# EasyEDA Pro project ProDocument_Board2_2024-09-15.epro, board PCB1_1
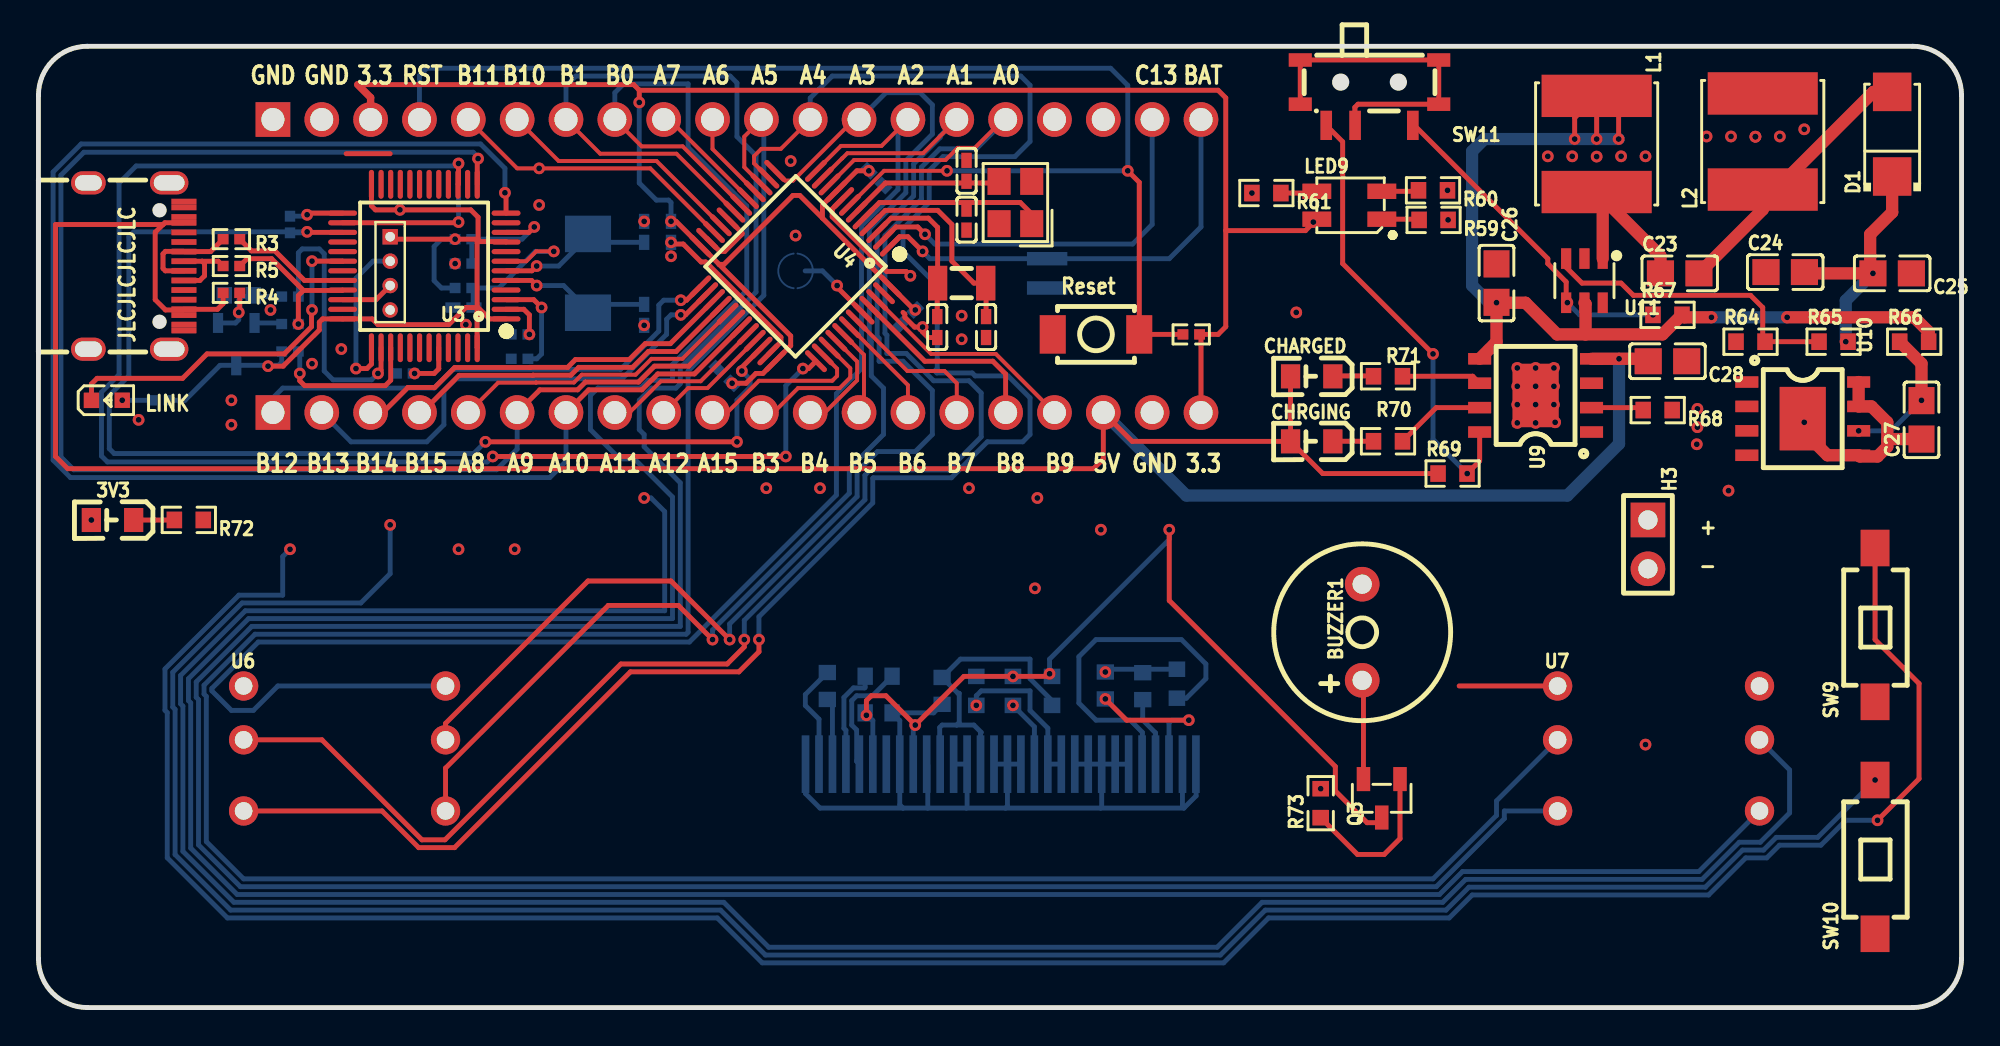
[diagram p1: board, top side]
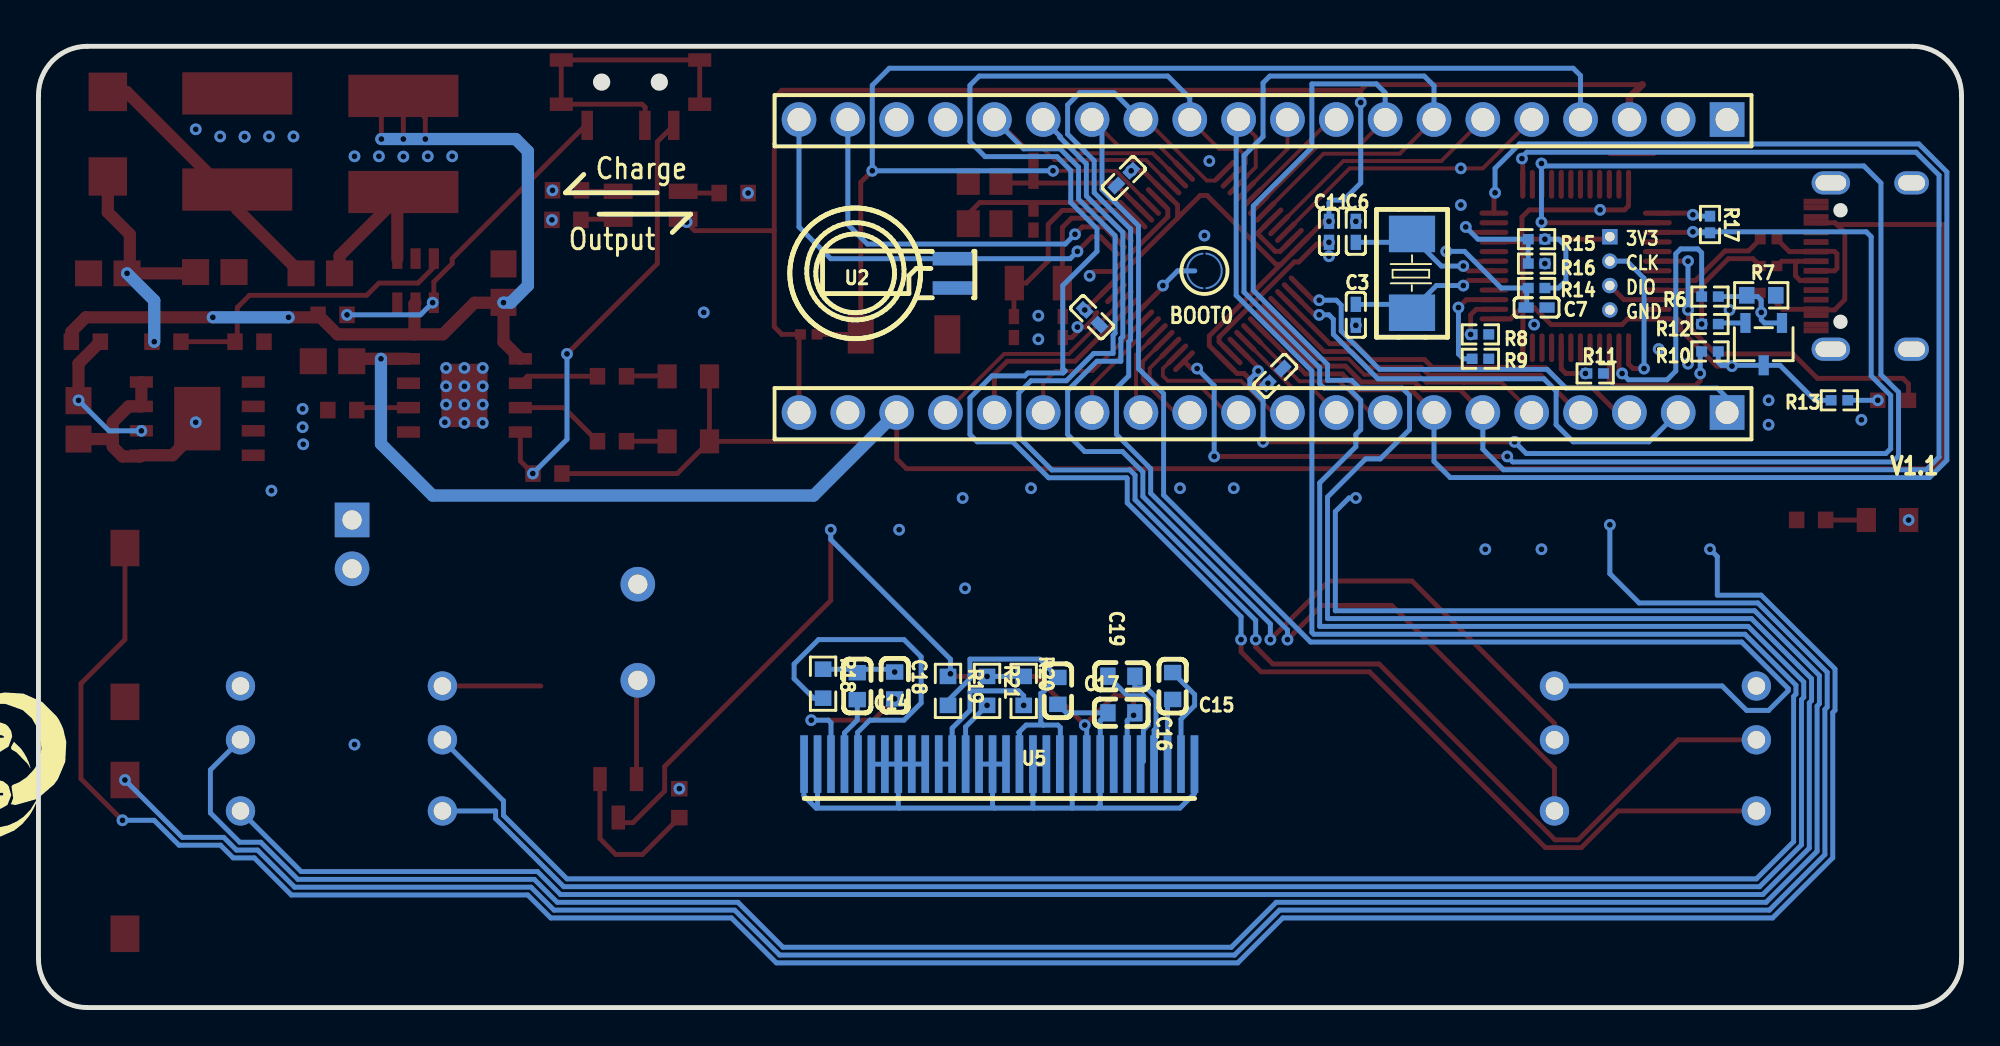
[diagram p2: board, bottom side, seen from below]

Outline 100 x 50 mm; copper layers: Top Layer, Inner1, Inner2, Bottom Layer. Coordinates in mm from the lower left corner of the outline.
Outline path: 0,47.46 0,2.54 arc(0.74,0.74) 2.54,0 97.46,0 arc(99.26,0.74) 100,2.54 100,47.46 arc(99.26,49.26) 97.46,50 2.54,50 arc(0.74,49.26) 0,47.46
Stack: Top Layer 0.035mm 外层铜厚1oz / Dielectric1 0.2104mm 7628 RC49% 8.6mil / Inner1 0.0152mm 内层铜厚 / Dielectric2 1.065mm 1.1mm H/HOZ 含铜 / Inner2 0.0152mm 内层铜厚 / Dielectric3 0.2104mm 7628 RC49% 8.6mil / Bottom Layer 0.035mm 外层铜厚1oz

## Design rules (mm)
spacing safeClearance (default): track to track 0.152, other pairs 0.152 to 0.3
track width trackWidth (default): min 0.127, default 0.254, max 2.54
differential pair differentialPair (default): width min 0.127, default 0.254, max 2.54; gap min 0.152, default 0.152
via viaSize (default): diameter min 0.5, default 0.61, max 10; hole min 0.3, default 0.305, max 6

## Placement (name value [footprint] x y rotation side)
3V3  -  [LED_0805]  3.8 25.36 180 top
BUZZER1  2.7kHz  [BUZ-TH_BD9.0-P5.00-D0.6-FD]  68.83 19.52 90 top
C3  20pF  [C0402]  31.5 36.03 270 bottom
C4  12pF  [C0402]  46.74 35.39 90 top
C5  12pF  [C0402]  49.28 35.39 270 top
C6  20pF  [C0402]  31.5 40.35 90 bottom
C7  100nF  [C0402]  22.1 36.41 0 bottom
C8  20pF  [C0402]  48.26 40.98 90 top
C9  20pF  [C0402]  48.26 43.52 270 top
C10  100nF  [C0402]  43.56 43.14 135 bottom
C11  100nF  [C0402]  32.89 40.35 90 bottom
C12  100nF  [C0402]  35.69 32.86 315 bottom
C13  100nF  [C0402]  45.21 35.9 45 bottom
C14  4.7uf  [C0603]  57.42 16.72 270 bottom
C15  1uf  [C0603]  43.69 17.23 0 bottom
C16  1uf  [C0603]  41.02 16.73 90 bottom
C17  10uf  [C0603]  43.69 15.33 180 bottom
C18  2.2uf  [C0603]  55.48 16.75 270 bottom
C19  100nF  [C0603]  46.99 16.47 270 bottom
C23  22uF  [C0805]  85.34 38.19 0 top
C24  22uF  [C0805]  90.83 38.26 0 top
C25  22uF  [C0805]  96.39 38.19 180 top
C26  22uF  [C0805]  75.82 37.68 270 top
C27  4.7uF  [C0805]  97.92 30.57 90 top
C28  22uF  [C0805]  84.71 33.62 180 top
CHARGED  -  [LED_0805]  66.16 32.84 180 top
CHRGING  -  [LED_0805]  66.16 29.46 180 top
D1  SS34  [SMA_L4.3-W2.6-LS5.2-RD]  96.39 45.43 90 top
H3  -  [HDR-TH_2P-P2.54-V-M-1]  83.69 24.09 270 top
J1  -  [HDR-TH_20P-P2.54-V-M-1]  36.32 46.19 0 bottom
J2  -  [HDR-TH_20P-P2.54-V-M-1]  36.32 30.95 0 bottom
L1  4.7uH  [IND-SMD_L6.0-W6.0]  81.03 44.92 270 top
L2  4.7uH  [IND-SMD_L6.0-W6.0]  89.66 45.05 90 top
LED2  NCD0603Y1  [LED0603-RD]  3.56 31.58 0 top
LED9  LED-RGB-3528  [LED 3528-4PIN]  68.17 41.73 0 top
P1  -  [1.27-4P烧录孔]  18.29 38.19 270 top
PAN1  -  [短接焊盘-2mm]  39.37 38.32 0 bottom
Q1  S8050 J3Y  [SOT-23-3_L3.0-W1.7-P0.95-LS2.9-BR]  10.29 34.51 90 bottom
Q3  S8550  [SOT-23-3_L2.9-W1.3-P1.90-LS2.4-BR]  69.85 10.88 90 top
R2  10kΩ  [R0402]  59.94 35.01 0 top
R3  10Ω  [R0402]  10.03 39.97 0 top
R4  10kΩ  [R0402]  10.03 37.17 180 top
R5  10Ω  [R0402]  10.03 38.57 0 top
R6  100Ω  [R0402]  13.08 36.98 0 bottom
R7  36kΩ  [R0603]  10.41 37.05 0 bottom
R8  10kΩ  [R0402]  25.02 35.01 180 bottom
R9  10kΩ  [R0402]  25.02 33.74 180 bottom
R10  4.7kΩ  [R0402]  13.08 34.12 180 bottom
R11  10kΩ  [R0402]  19.05 32.98 0 bottom
R12  1.5kΩ  [R0402]  13.08 35.55 180 bottom
R13  1kΩ  [R0402]  6.35 31.58 180 bottom
R14  100kΩ  [R0402]  22.1 37.43 180 bottom
R15  4.7kΩ  [R0402]  22.1 39.97 180 bottom
R16  4.7kΩ  [R0402]  22.1 38.7 0 bottom
R17  100Ω  [R0402]  13.08 40.73 270 bottom
R18  1M  [R0603]  59.2 16.84 270 bottom
R19  5.1k  [R0603]  52.71 16.47 270 bottom
R20  5.1k  [R0603]  48.77 16.47 270 bottom
R21  5.1k  [R0603]  50.67 16.47 270 bottom
R59  1k  [R0603]  72.55 40.97 180 top
R60  2k  [R0603]  72.52 42.51 180 top
R61  510  [R0603]  63.85 42.37 180 top
R64  2K  [R0603]  89.03 34.63 0 top
R65  9.1K  [R0603]  93.34 34.63 0 top
R66  100  [R0603]  97.54 34.63 0 top
R67  100K  [R0603]  84.71 36.03 0 top
R68  1.2K  [R0603]  84.2 31.08 180 top
R69  100K  [R0603]  73.53 27.78 0 top
R70  1.2K  [R0603]  70.18 29.46 180 top
R71  1.2K  [R0603]  70.18 32.84 180 top
R72  1.2K  [R0603]  7.82 25.36 180 top
R73  1kΩ  [R0603]  66.68 10.63 90 top
SW1  -  [SW-SMD_L3.9-W2.9-P4.15-LS5.0]  54.99 35.01 0 top
SW9  TS-1101-C-W  [SW-SMD_L6.0-W3.3-LS8.0]  95.5 19.9 90 top
SW10  TS-1101-C-W  [SW-SMD_L6.0-W3.3-LS8.0]  95.5 7.84 90 top
SW11  MSK12C02  [SW-TH_MSK12C02]  69.22 47.59 180 top
U2  -  [CAP-SMD_FL11E]  52.45 38.19 180 bottom
U3  STM32F103CBT6  [LQFP-48_L7.0-W7.0-P0.50-LS9.0-BL]  20.07 38.57 90 top
U4  -  [LQFP-48_L7.0-W7.0-P0.50-LS9.0-BL]  39.37 38.57 135 top
U5  SSD1306  [1.3OLED-2]  50.42 13.42 0 bottom
U6  -  [直插五向开关]  10.67 16.73 0 top
U7  -  [直插五向开关]  78.99 16.73 0 top
U9  TP4056-42-ESOP8  [ESOP-8_L4.9-W3.9-P1.27-LS6.0-BL-EP]  77.85 31.84 90 top
U10  IP3005A  [ESOP-8_L4.9-W3.9-P1.27-LS6.0-BL-EP]  91.74 30.63 270 top
U11  MT3608  [SOT-23-6_L2.9-W1.6-P0.95-LS2.8-BL]  80.39 37.81 180 top
USB1  -  [USB-C_SMD-TYPE-C-31-M-12]  5.08 38.57 270 top
X1  32.768kHz  [FC-135R_L3.2-W1.5]  48.01 37.68 0 top
X2  8MHz  [CRYSTAL-SMD_L5.0-W3.2]  28.57 38.19 270 bottom
X3  8MHz  [CRYSTAL-SMD_4P-L3.2-W2.5-BL]  50.8 41.87 90 top

## Footprints (pads in the part's own frame, mm; a bottom-side part is the same pattern mirrored in y, then rotated)
1.3OLED-2
  rect 0.4x3 smd: 1(-10.531,0.762) 2(-9.831,0.763) 3(-9.131,0.762) 4(-8.431,0.762) 5(-7.731,0.762) 6(-7.031,0.762) 7(-6.331,0.762) 8(-5.631,0.762) 9(-4.931,0.762) 10(-4.231,0.762) 11(-3.531,0.762) 12(-2.831,0.762) 13(-2.131,0.762) 14(-1.431,0.762) 15(-0.731,0.762) 16(-0.031,0.762) 17(0.669,0.762) 18(1.369,0.762) 19(2.069,0.763) 20(2.769,0.762) 21(3.469,0.761) 22(4.169,0.762) 23(4.869,0.762) 24(5.569,0.762) 25(6.269,0.763) 26(6.969,0.762) 27(7.669,0.763) 28(8.369,0.762) 29(9.069,0.762) 30(9.769,0.762)
1.27-4P烧录孔
  rect 0.8x0.8 hole 0.5: 1(-1.905,0)
  round 0.8 hole 0.5: 2(-0.635,0) 3(0.635,0) 4(1.905,0)
BUZ-TH_BD9.0-P5.00-D0.6-FD
  round 1.8 hole 1: 1(-2.5,0) 2(2.5,0)
C0402
  rect 0.79x0.54 smd: 1(-0.545,0) 2(0.545,0)
C0603
  rect 0.8x0.9 smd: 1(-0.7,0) 2(0.7,0)
C0805
  rect 1.41x1.35 smd: 1(-1,0) 2(1,0)
CAP-SMD_FL11E
  rect 2.1x0.7 smd: 1(0,0.762) 2(0,-0.762)
CRYSTAL-SMD_4P-L3.2-W2.5-BL
  rect 1.4x1.2 smd: 1(-1.1,-0.85) 2(1.1,-0.85) 3(1.1,0.85) 4(-1.1,0.85)
CRYSTAL-SMD_L5.0-W3.2
  rect 1.9x2.401 smd: 1(-2.05,0) 2(2.05,0)
ESOP-8_L4.9-W3.9-P1.27-LS6.0-BL-EP
  rect 0.6x1.2 smd: 1(-1.905,-2.909) 2(-0.635,-2.909) 3(0.635,-2.909) 4(1.905,-2.909) 5(1.905,2.909) 6(0.635,2.909) 7(-0.635,2.909) 8(-1.905,2.909)
  rect 3.3x2.4 smd: 9(0,0)
FC-135R_L3.2-W1.5
  rect 1.001x1.801 smd: 1(-1.25,0) 2(1.25,0)
HDR-TH_2P-P2.54-V-M-1
  rect 1.8x1.8 hole 1: 1(-1.27,0)
  round 1.8 hole 1: 2(1.27,0)
HDR-TH_20P-P2.54-V-M-1
  rect 1.801x1.801 hole 1.199: 1(-24.13,0)
  round 1.801 hole 1.199: 2(-21.59,0) 3(-19.05,0) 4(-16.51,0) 5(-13.97,0) 6(-11.43,0) 7(-8.89,0) 8(-6.35,0) 9(-3.81,0) 10(-1.27,0) 11(1.27,0) 12(3.81,0) 13(6.35,0) 14(8.89,0) 15(11.43,0) 16(13.97,0) 17(16.51,0) 18(19.05,0) 19(21.59,0) 20(24.13,0)
IND-SMD_L6.0-W6.0
  rect 2.2x5.72 smd: 1(-2.5,0) 2(2.5,0)
LED0603-RD
  rect 0.8x0.8 smd: 1(-0.799,-0.004) 2(0.799,0.004)
LED 3528-4PIN
  custom 1.5x0.8 smd: 1(1.689,-0.725) 2(-1.689,-0.725) 3(-1.689,0.725) 4(1.689,0.725)
LED_0805
  rect 1x1.25 smd: 1(-1.15,0.005) 2(1.05,0.005)
LQFP-48_L7.0-W7.0-P0.50-LS9.0-BL
  oval 0.269x1.501 smd: 1(-2.751,-4.25) 2(-2.251,-4.25) 3(-1.75,-4.25) 4(-1.25,-4.25) 5(-0.75,-4.25) 6(-0.249,-4.25) 7(0.249,-4.25) 8(0.75,-4.25) 9(1.25,-4.25) 10(1.75,-4.25) 11(2.251,-4.25) 12(2.751,-4.25) 25(2.751,4.25) 26(2.251,4.25) 27(1.75,4.25) 28(1.25,4.25) 29(0.75,4.25) 30(0.249,4.25) 31(-0.249,4.25) 32(-0.75,4.25) 33(-1.25,4.25) 34(-1.75,4.25) 35(-2.251,4.25) 36(-2.751,4.25)
  oval 1.501x0.269 smd: 13(4.25,-2.751) 14(4.25,-2.251) 15(4.25,-1.75) 16(4.25,-1.25) 17(4.25,-0.75) 18(4.25,-0.249) 19(4.25,0.249) 20(4.25,0.75) 21(4.25,1.25) 22(4.25,1.75) 23(4.25,2.251) 24(4.25,2.751) 37(-4.25,2.751) 38(-4.25,2.251) 39(-4.25,1.75) 40(-4.25,1.25) 41(-4.25,0.75) 42(-4.25,0.249) 43(-4.25,-0.249) 44(-4.25,-0.75) 45(-4.25,-1.25) 46(-4.25,-1.75) 47(-4.25,-2.251) 48(-4.25,-2.751)
R0402
  rect 0.566x0.54 smd: 1(-0.433,0) 2(0.433,0)
R0603
  rect 0.806x0.864 smd: 1(-0.753,0) 2(0.753,0)
SMA_L4.3-W2.6-LS5.2-RD
  rect 2x2 smd: 1(-2.2,0) 2(2.2,0)
SOT-23-3_L2.9-W1.3-P1.90-LS2.4-BR
  rect 1.25x0.7 smd: 1(1,-0.95) 2(1,0.95) 3(-1,0)
SOT-23-3_L3.0-W1.7-P0.95-LS2.9-BR
  rect 1.038x0.532 smd: 1(1.101,-0.95) 2(1.101,0.95) 3(-1.101,0)
SOT-23-6_L2.9-W1.6-P0.95-LS2.8-BL
  rect 0.532x1.072 smd: 1(-0.95,-1.149) 2(0,-1.149) 3(0.95,-1.149) 4(0.95,1.149) 5(0,1.149) 6(-0.95,1.149)
SW-SMD_L3.9-W2.9-P4.15-LS5.0
  rect 1.351x1.999 smd: 1(-2.251,0) 2(2.251,0)
SW-SMD_L6.0-W3.3-LS8.0
  rect 1.9x1.5 smd: 1(-4,0) 2(4,0)
SW-TH_MSK12C02
  rect 0.6x1.524 smd: 1(-2.25,1.7) 2(0.75,1.7) 3(2.25,1.7)
  rect 1.2x0.7 smd: 4(-3.6,0.6) 4(-3.6,-1.7) 4(3.6,0.6) 4(3.6,-1.7)
USB-C_SMD-TYPE-C-31-M-12
  oval 1.2x2 hole 0.8x1.6: 0(-4.325,1.716) 0(4.325,1.716)
  oval 1.2x1.8 hole 0.8x1.4: 0(-4.325,-2.484) 0(4.325,-2.484)
  rect 0.3x1.3 smd: A1(-3.35,2.484) A4(-2.55,2.484) A5(-1.25,2.484) A6(-0.25,2.484) A7(0.25,2.484) A8(1.25,2.484) A9(2.55,2.484) A12(3.35,2.484) B1(3.05,2.484) B4(2.25,2.484) B5(1.75,2.484) B6(0.75,2.484) B7(-0.75,2.484) B8(-1.75,2.484) B9(-2.25,2.484) B12(-3.05,2.484)
直插五向开关
  round 1.524 hole 0.914: 1(0,0) 2(0,-2.8) 3(0,-6.5) 4(10.5,0) 5(10.5,-2.8) 6(10.5,-6.5)
短接焊盘-2mm
  custom 0.8x1.8 smd: 1(-0.5,0) 2(0.5,0)

## Nets
As in the schematic, except:
3V3: 3V3.2 C10.2 C11.2 C12.2 C13.2 C17.2 C24.2 C25.2 D1.1 J1.3 J2.20 LED9.2 P1.1 Q1.3 Q3.3 R2.2 R10.2 R13.1 R14.2 R15.2 R19.1 R20.1 R21.1 R65.2 U3.1 U3.9 U3.24 U3.36 U3.48 U4.9 U4.24 U4.36 U4.48 U5.6 U5.9
+5V: C28.2 CHARGED.2 CHRGING.2 J2.18 R4.2 R69.1 U9.4 USB1.A4 USB1.A9 USB1.B4 USB1.B9
$1N40276: CHRGING.1 R70.2
$1N40277: CHARGED.1 R71.2
$1N44946: 3V3.1 R72.2

Pads without a net: J1 17 18; U3 4 11 14 16 17 18 19 21 22 28 29 31 40 41 42 43 45 46; U5 7; U10 1; U11 6; USB1 A5 A8 B5 B8

## Via types
v1: diameter 0.61, hole 0.305, Top Layer to Bottom Layer, 140 vias

## Routing (per net, layer and track width the routed paths; a pad name or vN(x,y) marks a point on that pad's centre or on a via; arc(x,y) is an arc through that point)
3V3: length 273.5
  Top Layer w0.254: U3.9 24.3,39.84 22.81,39.84 22.81,36.41 ; 40.77,41.06 U4.48 45.55,36.28 v1(45.59,36.28) ; 40.77,41.06 40.77,41.75 41.48,42.46 U4.9 42.56,43.52 v1(43.18,43.52) ; 40.77,41.06 39.59,42.24 39.23,42.24 35.65,38.66 35.39,38.66 ; 31.24,47.71 30.95,48 16.6,48 ; 31.24,47.71 61.34,47.71 61.74,47.31 61.74,40.41 ; 31.24,47.71 v1(31.24,47.08) ; v1(66.29,40.86) 66.44,41.01 LED9.2 65.88,40.41 61.74,40.41 ; v1(43.05,15.2) 43.05,15.96 43.31,16.22 44.07,16.22 v1(45.59,14.69) 48.12,17.22 v1(50.67,17.22) 52.58,17.22 v1(52.58,17.36) ; 61.74,40.41 61.74,35.41 61.34,35.01 R2.2 60.45,34.94 J2.20 ; 22.81,36.41 22.22,36.41 21.34,35.52 17.65,35.52 17.36,35.82 14.78,35.82 14.61,35.65 14.61,35.24 12.73,33.36 v1(11.94,33.36) ; 22.81,36.41 22.81,34.33 U3.48 ; 24.32,35.82 23.45,35.82 22.86,36.41 ; 35.39,38.66 39.12,34.93 39.12,34.43 U4.36 37.67,32.98 37.31,32.98 36.8,32.47 v1(36.07,32.47) ; 35.39,38.66 U4.24 33.16,40.89 v1(32.89,40.89) ; Q3.3 69.58,9.61 69.09,9.61 67.44,11.27 67.44,12.53 58.8,21.17 v1(58.8,24.85) ; U3.24 17.31,41.7 17.53,41.49 v1(18.8,41.49) 22.48,41.49 22.86,41.11 22.86,39.97 v1(21.67,39.97) 18.42,39.97 P1.1
  Top Layer w0.381: 16.6,48 17.27,47.33 J1.3
  Top Layer w0.635: D1.1 96.39,41.36 95.25,40.22 95.25,38.33 v1(95.39,38.19) 91.9,38.19 C24.2 ; v1(93.98,34.63) R65.2
  Inner1 w0.254: v1(66.29,40.86) 72.52,34.63 v1(93.98,34.63) ; v1(18.8,41.49) 17.65,41.49 17.27,41.87 J1.3 ; v1(11.94,33.36) 11.3,33.36 10.54,32.6 9.99,32.6 v1(2.75,25.36) ; J2.20 58.8,29.3 v1(58.8,24.85)
  Bottom Layer w0.254: U5.9 45.49,14.59 v1(45.59,14.69) ; R10.2 12.65,33.56 12.49,33.4 Q1.3 9.44,33.4 7.62,31.58 R13.1 ; R14.2 20.95,37.43 20.57,37.81 20.57,39.59 20.95,39.97 v1(21.67,39.97) ; 48.77,17.22 v1(50.67,17.22) ; 52.71,17.22 52.71,17.23 v1(52.58,17.36) 52.58,18.12 58.8,24.35 v1(58.8,24.85) ; U5.6 43.39,14.93 C17.2 42.99,15.27 v1(43.05,15.2) ; v1(32.89,40.89) 32.89,41.87 32.77,42 32.13,42 31.24,42.89 v1(31.24,47.08)
  Bottom Layer w0.635: v1(95.39,38.19) 93.98,36.78 v1(93.98,34.63)
+5V: length 143.9
  Top Layer w0.254: 6.48,40.73 6.57,40.82 USB1.B9 ; R4.2 9.6,36.61 9.31,36.32 USB1.B4 7.53,36.28 6.61,36.28 6.07,36.82 6.07,40.32 6.48,40.73 0.89,40.73 0.89,28.66 1.52,28.03 54.86,28.03 55.37,28.54 J2.18 56.87,29.45 CHRGING.2 ; R69.1 66.78,27.78 CHRGING.2 ; CHRGING.2 CHARGED.2
  Top Layer w0.635: C28.2 83.58,33.74 v1(82.19,33.74) U9.4
  Bottom Layer w0.635: J2.18 59.69,26.63 79.5,26.63 82.19,29.32 v1(82.19,33.74)
GND: length 111.7
  Top Layer w0.254: v1(32.89,39.8) 32.98,39.71 33.53,39.71 34.46,38.78 34.69,38.78 38.61,34.87 38.61,34.63 U4.35 ; U7.1 73.88,16.73 ; U4.8 41.28,41.53 41.28,41.13 44.12,38.29 45.11,38.29 v1(45.34,38.06) ; 18.29,44.41 16,44.41 ; SW11.4 SW11.4 SW11.4 SW11.4 68.62,46.99 68.45,46.83 68.45,45.9 SW11.2 ; C4.1 46.26,34.85 45.97,35.14 v1(45.97,35.39) 45.56,35.39 45.05,35.9 45.05,36.06 44.96,36.16 ; U4.20 36.58,40.3 36.58,40.23 35.69,39.33 35.43,39.33 34.78,39.98 U4.23
  Inner1 w0.254: v1(51.82,21.81) 55.48,18.14 v1(55.48,17.45) ; v1(26.03,41.75) 26.67,41.11 26.67,40.35 25.02,38.7 v1(21.67,38.7)
  Bottom Layer w0.254: U5.30 60.2,12.65 60.2,11.01 59.56,10.38 ; 48.25,10.38 48.29,10.42 U5.13 U5.12 ; 48.25,10.38 50.28,10.38 ; 48.25,10.38 46.24,10.38 ; U5.1 39.89,11.13 40.64,10.38 44.96,10.38 ; 55.23,10.38 59.56,10.38 ; 55.23,10.38 55.29,10.43 U5.23 ; 55.23,10.38 50.28,10.38 ; 59.56,10.38 59.49,10.45 U5.29 ; R18.1 55.62,17.6 v1(55.48,17.45) ; U5.16 U5.17 ; U5.16 50.39,10.48 50.28,10.38 ; U5.16 U5.15 ; 46.24,10.38 46.24,12.61 U5.10 ; 46.24,10.38 44.96,10.38 ; U5.23 U5.24 ; U5.23 U5.22 U5.21 ; U5.25 55.99,12.66 ; C19.2 46.55,15.33 C17.1 44.79,14.93 U5.8 44.79,10.55 44.96,10.38
  vias: v1(5.21,30.57) v1(10.03,31.58) v1(10.03,30.31) v1(12.06,36.28) v1(14.22,33.49) v1(15.75,34.25) v1(21.84,23.84) v1(22.22,35.52) v1(24.77,23.84) v1(31.5,40.89) v1(31.5,35.48) v1(32.89,39.08) v1(39.12,44.03) v1(39.37,40.15) v1(48.01,35.99) v1(48.01,34.76) v1(55.25,24.85) v1(65.41,36.16) v1(76.9,33.27) v1(76.9,32.32) v1(76.9,31.36) v1(76.9,30.41) v1(77.85,33.27) v1(77.85,32.32) v1(77.85,31.36) v1(77.85,30.41) v1(78.49,44.28) v1(78.8,33.27) v1(78.8,32.32) v1(78.8,31.36) v1(78.87,30.44) v1(79.76,44.28) v1(81.03,44.26) v1(82.3,44.28) v1(83.57,44.28) v1(83.57,13.68) v1(86.23,29.3) v1(86.26,31.14) v1(86.26,30.19) v1(86.74,45.31) v1(87.88,26.89) v1(88.01,45.31) v1(89.28,45.3) v1(89.28,45.29) v1(90.55,45.31) v1(91.82,45.68)
VBAT: length 23.1
  Top Layer w0.254: U4.1 44.78,40.09 45.21,40.09 v1(45.97,39.33)
  Bottom Layer w0.254: J1.20 60.45,40.6 58.8,38.95 U2.1 46.35,38.95 v1(45.97,39.33)
6050_SCL: length 12.9
  Top Layer w0.203: U4.21 32.14,44.03 27.05,44.03 J1.6
6050_SDA: length 15.2
  Top Layer w0.203: U4.22 31.81,43.65 v1(26.03,43.65) ; 26.01,43.65 24.89,43.65 J1.5
  Top Layer w0.254: v1(26.03,43.65) 26.01,43.65
BACK1: length 64
  Top Layer w0.203: J1.13 42.42,46.19 39.24,43.02 38.81,43.02 U4.13
  Top Layer w0.254: v1(35.05,19.14) 33.27,20.92 29.63,20.92 21.17,12.45 U6.6
  Bottom Layer w0.254: J1.13 44.07,47.59 45.85,47.59 46.48,46.95 46.48,45.43 45.1,44.05 45.1,42.38 43.21,40.49 43.21,34.73 43.31,34.63 43.31,32.86 43.94,32.22 43.94,29.81 42.16,28.03 42.16,26.75 35.05,19.64 v1(35.05,19.14)
BACK2: length 170.2
  Top Layer w0.203: J1.8 31.37,44.79 33.5,44.79 36.54,41.75
  Bottom Layer w0.254: U7.6 86.34,7.07 74.05,7.07 72.85,5.88 10.33,5.88 7.92,8.29 7.92,15.85 7.8,15.97 7.8,17.1 10.92,20.23 32.97,20.23 32.97,26.56 30.99,28.54 30.23,28.54 28.7,30.06 28.7,31.84 29.08,32.22 31.3,32.22 31.71,32.63 32.97,32.63 32.97,33.45 36.83,37.31 36.83,41.69 33.78,44.74 33.78,48.04 30.43,48.04 29.97,47.59 J1.8
BAT+: length 65.9
  Top Layer w0.254: 81.03,47.21 L1.1 79.88,46.28 v1(79.88,45.17) ; 81.03,47.21 v1(81.03,45.17) ; 81.03,47.21 81.51,47.21 82.17,46.55 v1(82.17,45.17)
  Top Layer w0.635: U11.5 80.45,36.6 80.45,35.01 ; 80.45,35.01 78.97,35.01 77.33,36.66 75.84,36.66 C26.2 v1(75.82,36.67) 75.82,34.62 U9.5 ; 80.45,35.01 84.45,35.01 R67.2 85.59,35.9 v1(87,35.9) ; v1(90.93,35.9) 97.54,35.9 98.29,35.15 R66.2
  Inner2 w0.635: v1(87,35.9) 87.12,35.78 87.12,28.39 83.82,25.09
  Bottom Layer w0.635: v1(90.93,35.9) v1(87,35.9) ; v1(82.17,45.17) v1(81.03,45.17) v1(79.88,45.17) 75.18,45.17 74.55,44.54 74.55,37.55 75.44,36.67 v1(75.82,36.67)
BAT-: length 24.5
  Top Layer w0.254: v1(91.82,30.44) 91.82,30.55 U10.9
  Top Layer w0.635: 96.14,29.5 96.21,29.57 C27.1 ; 96.14,29.5 96.14,30.44 95.31,31.27 U10.7 U10.8 ; 96.14,29.5 96.14,29.17 95.63,28.66 94.71,28.66 U10.5 93.03,28.73 91.74,30.01 U10.9
  Inner2 w0.635: 83.82,23.09 86.63,23.09 91.82,28.28 v1(91.82,30.44)
BOOT0: length 4
  Top Layer w0.254: v1(41.53,37.55) 41.53,37.47 U4.44
  Bottom Layer w0.254: v1(41.53,37.55) 40.77,38.32 PAN1.2
BUZZER: length 59.6
  Top Layer w0.203: U4.32 34.44,32.58 32.36,32.58 30.73,30.95 J2.8
  Inner1 w0.254: v1(40.64,27.01) v1(37.85,27.01)
  Inner2 w0.254: J2.8 33.91,27.01 v1(37.85,27.01) ; v1(40.64,27.01) 42.04,28.41 58.29,28.41 66.68,20.03 v1(66.68,11.38)
CHARGE_EN: length 23.6
  Top Layer w0.254: v1(72.52,34) 67.82,38.7 67.82,45.03 SW11.3 ; v1(74.29,27.78) R69.2 74.94,28.43 U9.8
  Bottom Layer w0.254: v1(74.29,27.78) 72.52,29.55 v1(72.52,34)
D+: length 4.1
  Top Layer w0.254: USB1.A6 8.51,38.82 ; 8.51,38.82 9.35,38.82 R5.1 ; 8.51,38.82 8.64,38.7 8.64,38.06 8.39,37.82 USB1.B6
D-: length 5.3
  Top Layer w0.254: USB1.A7 6.6,38.32 6.48,38.44 6.48,39.2 6.6,39.33 7.55,39.33 USB1.B7 8.95,39.32 R3.1
FRONT1: length 76.8
  Top Layer w0.203: U4.12 41.73,44.82 43.84,44.82 J1.14
  Bottom Layer w0.254: U6.4 12.45,16.73 11.18,15.46 10.03,15.46 9.02,16.47 9.02,16.6 11.43,19.01 33.85,19.01 41.49,26.66 41.49,31.93 42.8,33.24 42.8,40.66 44.7,42.55 44.7,45.67 J1.14
FRONT2: length 92.3
  Top Layer w0.203: J1.9 32.81,46.19 U4.17
  Inner1 w0.254: J1.9 34.65,44.06 34.65,35.37 32.51,33.24 32,33.24 31.24,32.47 31.24,29.93 30.48,29.17 30.48,25.49 31.75,24.22 79.5,24.22 87,16.73 U7.4
LED_B: length 66.3
  Top Layer w0.203: U4.29 33.48,33.74 31.88,33.74 31.05,32.92 28.25,32.92 27.84,32.51 25.88,32.51 25.87,32.5 23.91,32.5 J2.5
  Inner2 w0.254: J2.5 23.37,31.97 23.37,36.67 22.73,37.3 22.73,39.33 25.77,42.37 v1(63.1,42.37)
LED_G: length 86.2
  Top Layer w0.254: J2.4 19.94,30.95 21.87,32.88 25.71,32.88 25.72,32.89 27.69,32.89 28.09,33.3 30.89,33.3 31.72,34.12 33.16,34.12 U4.28
  Inner2 w0.254: J2.4 19.81,30.19 22.48,27.52 23.37,27.52 24.26,28.41 24.26,29.81 23.62,30.44 23.62,31.2 23.77,31.36 23.77,32.12 24.38,32.73 24.38,38.19 28.15,41.96 57.06,41.96 57.66,41.36 63.12,41.36 64.26,42.51 v1(73.27,42.51)
LED_R: length 92.8
  Top Layer w0.254: J2.3 17.91,30.95 19.21,32.25 20.61,32.25 21.64,33.29 25.54,33.29 25.55,33.3 27.52,33.3 27.92,33.7 30.72,33.7 31.55,34.53 32.86,34.53 U4.27
  Inner2 w0.254: J2.3 17.53,30.7 17.53,29.93 17.68,29.78 19.64,29.78 22.31,27.11 23.54,27.11 23.97,27.55 24.77,26.76 26.16,28.16 26.16,33.36 27.81,35.01 27.81,41.04 28.32,41.55 56.89,41.55 57.49,40.96 63.29,40.96 64.43,42.1 72.17,42.1 v1(73.3,40.97)
LED_STLINK: length 18.5
  Top Layer w0.254: v1(14.22,38.82) 15.81,38.82 15.82,38.82 ; LED2.1 2.76,32.44 3.05,32.73 7.49,32.73 8.76,34 12.79,34 14.2,35.41 14.2,36.26 v1(14.22,36.28)
  Bottom Layer w0.254: v1(14.22,38.82) v1(14.22,36.28)
LEFT1: length 85.3
  Top Layer w0.203: J1.16 50.16,46.19 48.69,44.72 47.8,44.72 47.17,44.08 42.41,44.08 U4.10
  Top Layer w0.254: U6.2 14.74,13.93 19.94,8.72 21.14,8.72 30.28,17.87 35.81,17.87 36.7,18.76 v1(36.7,19.14)
  Bottom Layer w0.254: J1.16 48.77,44.67 46.87,44.67 45.92,43.71 45.92,42.05 44.02,40.15 44.02,35.07 44.12,34.97 44.12,34.02 45.13,34.02 46.55,32.6 48.39,32.6 49.02,31.97 49.02,29.68 47.3,27.96 43.25,27.96 42.98,27.69 42.98,26.42 36.7,20.14 v1(36.7,19.14)
LEFT2: length 141.5
  Top Layer w0.203: J1.11 36.7,45.3 36.7,43.71 U4.15
  Bottom Layer w0.254: J1.11 37.72,46.06 37.72,37.05 33.78,33.11 33.78,19.52 33.68,19.42 11.26,19.42 8.61,16.77 8.61,16.3 8.73,16.18 8.73,8.63 10.67,6.69 72.52,6.69 75.82,10 75.82,10.75 U7.2
NRST: length 70.3
  Top Layer w0.203: v1(47.24,43.52) 43.97,43.52 42.2,41.75
  Top Layer w0.254: v1(56.64,43.52) 57.24,42.92 SW1.2 R2.1
  Bottom Layer w0.254: v1(47.24,43.52) v1(56.64,43.52) 56.64,47.97 55.75,48.86 20.19,48.86 19.81,48.48 J1.4
OUTPUT_EN: length 17.4
  Top Layer w0.254: SW11.1 71.55,45.89 78.49,38.95 78.49,38.7 79.44,37.74 U11.4 79.45,36.67 v1(79.5,36.67)
  Bottom Layer w0.254: v1(83.96,36.03) 80.14,36.03 v1(79.5,36.67)
PA1: length 64.4
  Top Layer w0.203: J1.15 46,44.44 42.06,44.44 41.79,44.17 41.78,44.17 U4.11
  Top Layer w0.254: v1(35.94,19.14) 32.89,22.19 28.57,22.19 21.17,14.78 U6.5
  Bottom Layer w0.254: J1.15 46.87,45.31 46.89,45.26 45.51,43.88 45.51,42.22 43.61,40.32 43.61,34.9 43.71,34.8 43.71,33.62 44.96,33.62 46.48,32.09 46.48,29.81 45.59,28.92 43.63,28.92 42.57,27.86 42.57,26.58 35.94,19.95 v1(35.94,19.14)
PA4: length 98.8
  Top Layer w0.203: U4.14 37.21,43.91 37.21,44.28 37.59,44.67 38.61,44.67 J1.12
  Top Layer w0.254: U6.3 17.86,10.23 19.77,8.32 21.64,8.32 30.78,17.46 36.42,17.46 37.47,18.5 v1(37.47,19.14)
  Bottom Layer w0.254: J1.12 40.13,47.31 41.28,48.45 51.08,48.45 51.56,47.97 51.56,45.05 50.77,44.26 47.04,44.26 46.32,43.54 46.32,41.88 44.96,40.52 44.96,39.33 46.74,37.55 46.74,33.24 46.61,33.11 46.72,33.01 48.56,33.01 48.71,32.86 50.42,32.86 51.56,31.71 51.56,29.81 51.18,29.43 49.34,29.43 47.47,27.56 43.41,27.56 43.38,27.52 43.38,26.25 37.47,20.33 v1(37.47,19.14)
PA6: length 161.1
  Top Layer w0.203: U4.16 35.05,44.66 J1.10
  Inner1 w0.254: J1.10 35.05,33.36 33.91,32.22 33.91,31.71 33.66,31.46 33.78,31.33 33.78,28.79 v1(31.5,26.5)
  Bottom Layer w0.254: U7.5 91.06,12.36 91.06,10.12 89.53,8.6 88.44,8.6 86.51,6.67 74.22,6.67 73.02,5.47 63.63,5.47 61.29,3.14 37.97,3.14 35.64,5.47 10.16,5.47 7.51,8.13 7.51,15.68 7.39,15.8 7.39,17.27 10.76,20.64 32.56,20.64 32.56,25.8 31.85,26.5 v1(31.5,26.5)
PA9/TX: length 78
  Top Layer w0.254: 36.19,35.74 33.81,33.36 32.03,33.36 31.21,32.54 28.44,32.54 28.04,32.13 26.07,32.13 J2.6 ; v1(22.86,44.16) 22.82,44.11 U3.13
  Bottom Layer w0.254: J2.6 24.89,29.05 23.82,27.97 1.83,27.97 1.17,28.64 1.17,43.29 2.36,44.49 22.61,44.49 22.86,44.23 v1(22.86,44.16)
PA10/RX: length 82.9
  Top Layer w0.254: 36.54,35.39 34.11,32.96 32.2,32.96 31.38,32.13 28.61,32.13 J2.7 ; v1(24.26,42.38) 24.32,42.32 U3.12
  Bottom Layer w0.254: J2.7 27.43,28.41 26.59,27.57 1.67,27.57 0.76,28.47 0.76,43.46 2.22,44.92 22.99,44.92 24.26,43.65 v1(24.26,42.38)
PA12: length 6.3
  Top Layer w0.203: U4.33 34.79,32.22 33.78,32.22 J2.9
PA13/SWD: length 62.4
  Top Layer w0.254: v1(13.97,40.35) 14,40.32 U3.27 ; v1(36.58,33.11) 36.58,33.3 U4.34 ; v1(36.32,29.43) v1(23.24,29.43)
  Bottom Layer w0.254: v1(36.32,29.43) 36.32,31.58 37.01,32.27 37.01,32.68 v1(36.58,33.11) ; v1(23.24,29.43) 22.63,28.82 3.94,28.82 3.68,29.07 3.68,31.84 4.7,32.86 4.7,40.09 4.95,40.35 v1(13.97,40.35) 13.92,40.3 R17.2
PA14/SWC: length 84.5
  Top Layer w0.254: U3.26 21.81,40.82 v1(21.84,40.86) ; U3.15 21.84,42.85 v1(21.84,43.9) ; U4.37 40.05,33.24 v1(39.75,33.24) ; v1(23.62,28.66) v1(38.86,28.66)
  Bottom Layer w0.254: v1(21.84,40.86) v1(21.84,43.9) 21.71,43.77 5.08,43.77 4.19,42.89 4.19,32.92 3.28,32.01 3.28,28.69 3.59,28.38 23.34,28.38 23.67,28.72 ; v1(39.75,33.24) 38.86,32.35 v1(38.86,28.66)
PA15: length 8.7
  Top Layer w0.203: J2.10 35.81,30.95 37.47,32.6 41.28,32.6 41.53,32.86 41.53,33.23 U4.38
PB1: length 162.9
  Top Layer w0.203: 36.19,41.4 33.18,44.41 29.21,44.41 J1.7
  Bottom Layer w0.254: U7.3 76.23,10.23 76.23,9.83 72.69,6.29 10.5,6.29 8.32,8.46 8.32,16.02 8.2,16.14 8.2,16.94 11.09,19.83 33.38,19.83 33.38,27.29 31.5,29.17 31.5,29.81 31.24,30.06 31.24,31.58 31.88,32.22 33.15,32.22 33.38,32.45 33.38,33.28 37.31,37.21 37.31,44.31 36.32,45.3 36.32,48.09 35.97,48.45 27.94,48.45 27.43,47.94 J1.7
PB3: length 7.4
  Top Layer w0.203: J2.11 38.23,30.95 39.5,32.22 41.66,32.22 42.22,32.77 42.22,33.25 U4.39
PB4: length 5.6
  Top Layer w0.203: J2.12 40.89,30.95 42.57,32.63 42.57,33.6 U4.40
PB5: length 4.6
  Top Layer w0.203: J2.13 42.93,31.2 42.93,33.95 U4.41
PB6: length 5.7
  Top Layer w0.203: J2.14 45.21,32.38 42.2,35.39
PB7: length 8.1
  Top Layer w0.203: 42.55,35.74 45.18,33.11 47.12,33.11 47.75,32.47 J2.15
PB8: length 35.4
  Top Layer w0.254: U4.45 46.09,33.62 49.63,33.62 50.29,32.95 J2.16
  Inner1 w0.254: J2.16 48.39,29.05 v1(48.39,27.01)
  Inner2 w0.254: v1(48.39,27.01) 46.74,25.36 46.74,16.22 48.51,14.44 49.39,14.44 v1(50.67,15.72)
  Bottom Layer w0.254: U5.18 51.79,14.6 v1(50.67,15.72)
PB9: length 36.9
  Top Layer w0.203: J2.17 49.78,34 46.42,34 U4.46
  Inner1 w0.254: J2.17 51.94,30.06 v1(51.94,26.5)
  Inner2 w0.254: v1(48.77,15.72) 48.77,23.33 v1(51.94,26.5)
  Bottom Layer w0.254: U5.20 52.49,12.66 ; U5.19 52.49,14.53 51.56,15.46 51.56,16.47 49.02,16.47 48.77,16.22 v1(48.77,15.72)
PB12: length 164.1
  Top Layer w0.254: v1(33.4,36.79) 33.7,36.79 U4.25 ; v1(95.63,9.74) 97.79,11.9 97.79,16.85 95.5,19.14 SW9.2
  Inner1 w0.254: J2.1 13.08,30.06 v1(13.08,23.84)
  Bottom Layer w0.254: v1(95.63,9.74) 93.98,9.74 92.69,8.45 90.53,8.45 89.87,7.78 88.78,7.78 86.85,5.86 74.55,5.86 73.36,4.66 63.96,4.66 61.63,2.32 37.64,2.32 35.3,4.66 9.83,4.66 6.7,7.79 6.7,15.34 6.58,15.46 6.58,17.61 10.42,21.45 12.7,21.45 12.7,23.46 v1(13.08,23.84) ; v1(33.4,36.79) 32.51,36.79 32.26,36.54 32.26,35.19 30.27,33.19 21.55,33.19 20.57,32.22 12.7,32.22 12.19,31.71 J2.1
PB13: length 152.5
  Top Layer w0.254: v1(33.4,36.03) 33.65,36.03 U4.26
  Inner1 w0.254: J2.2 18.29,27.39 v1(18.29,25.11)
  Bottom Layer w0.254: v1(33.4,36.03) 32.89,36.03 32.66,35.8 32.66,35.02 30.35,32.7 21.72,32.7 21.08,32.07 21.08,30.31 20.19,29.43 16.26,29.43 J2.2 ; v1(95.5,11.84) 92.52,8.85 90.36,8.85 89.7,8.19 88.61,8.19 86.68,6.26 74.38,6.26 73.19,5.07 63.8,5.07 61.46,2.73 37.8,2.73 35.47,5.07 9.99,5.07 7.1,7.96 7.1,15.51 6.98,15.63 6.98,17.44 10.59,21.04 16.76,21.04 18.29,22.57 v1(18.29,25.11)
PC13: length 20.5
  Top Layer w0.254: U4.2 44.58,40.6 45.72,40.6 v1(46.1,40.22)
  Bottom Layer w0.254: J1.19 57.91,40.73 56.9,39.71 46.61,39.71 v1(46.1,40.22)
PC14: length 8.3
  Top Layer w0.254: U4.3 44.33,41.06 46.28,41.06 46.76,40.58 X1.1 46.74,37.66 C4.2
PC15: length 10.8
  Top Layer w0.254: C5.1 49.28,37.66 X1.2 48.64,37.68 47.5,38.82 47.5,40.73 46.76,41.47 44.03,41.47 U4.4
PD0: length 9.8
  Top Layer w0.254: U4.5 43.73,41.87 51.05,41.87 51.65,41.28 X3.1
PD1: length 8.1
  Top Layer w0.254: 42.55,41.4 44.04,42.89 49.87,42.89 X3.3
ST_SWCLK: length 8.6
  Top Layer w0.254: v1(16.51,33.24) 17.08,33.24 17.31,33.47 U3.37
  Bottom Layer w0.254: P1.2 17.4,38.82 16.51,37.94 v1(16.51,33.24)
ST_SWDIO: length 2.8
  Top Layer w0.254: U3.34 17.55,36.82 P1.3
USB_D+: length 8.1
  Top Layer w0.254: 13.78,37.3 15.8,37.3 U3.33 ; 13.78,37.3 13.51,37.04 v1(13.51,35.55) ; 13.78,37.3 12.13,38.95 10.85,38.95 R5.2
USB_D-: length 6.2
  Top Layer w0.254: U3.32 13.83,37.82 12.29,39.36 11.08,39.36 R3.2
USB_RENUMN: length 14.4
  Top Layer w0.254: U3.38 17.82,33.14 v1(17.65,32.98)
  Bottom Layer w0.254: R6.2 13.51,39.26 13.72,39.46 14.61,39.46 14.86,39.2 14.86,33.11 15.32,32.65 17.32,32.65 v1(17.65,32.98)
$1N12780: length 1.4
  Bottom Layer w0.254: 11.24,35.61 12.59,35.61 R12.2
$1N12782: length 5.5
  Top Layer w0.254: R4.1 10.47,36.21 v1(10.41,36.16)
  Bottom Layer w0.254: Q1.1 10.25,35.61 10.41,35.78 v1(10.41,36.16) 10.41,36.79 10.6,36.98 R6.1
$1N12786: length 2.3
  Top Layer w0.254: U3.2 25.24,36.32 25.53,36.03 v1(25.53,35.01)
$1N12787: length 5.2
  Top Layer w0.254: v1(26.16,36.41) 25.75,36.82 U3.3
  Bottom Layer w0.254: R9.1 25.91,33.74 26.16,34 v1(26.16,36.41)
$1N12790: length 7.4
  Top Layer w0.254: v1(25.91,37.55) 25.64,37.82 U3.5
  Bottom Layer w0.254: 28.57,36.28 27.31,37.55 v1(25.91,37.55) ; C3.1 29.01,36.58
$1N12791: length 7.8
  Top Layer w0.254: v1(25.91,38.57) 25.66,38.32 U3.6
  Bottom Layer w0.254: 28.57,40.09 27.05,38.57 v1(25.91,38.57) ; C6.1 28.74,39.8
$1N12796: length 6.4
  Top Layer w0.254: U3.10 25.5,40.32 v1(25.78,40.6)
  Bottom Layer w0.254: R16.2 R15.1 25.15,39.97 v1(25.78,40.6)
$1N12798: length 8.8
  Top Layer w0.203: v1(26.8,39.33) 25.88,39.33 25.37,38.82 24.32,38.82
  Bottom Layer w0.254: C7.2 22.61,36.45 22.61,37.35 R14.1 23.94,37.43 25.84,39.33 v1(26.8,39.33)
$1N12808: length 2.8
  Top Layer w0.254: v1(13.97,41.24) 14.05,41.32 U3.25
  Bottom Layer w0.254: v1(13.97,41.24) 13.89,41.16 R17.1
$1N12820: length 8.2
  Top Layer w0.254: v1(13.59,32.98) 13.59,32.6 13.84,32.35 18.03,32.35 18.32,32.63 U3.39
  Bottom Layer w0.254: v1(13.59,32.98) 13.59,34.05 R10.1
$1N12821: length 2.5
  Top Layer w0.254: U3.44 20.82,33.22 20.57,32.98 v1(19.56,32.98)
$1N12835: length 1.6
  Bottom Layer w0.254: R13.2 4.36,31.58 v1(4.36,31.59)
$1N33098: length 18.2
  Bottom Layer w0.254: R18.2 59.69,16.09 60.71,17.11 60.71,17.87 59.44,19.14 54.99,19.14 54.1,18.25 54.1,15.84 54.99,14.95 56.77,14.95 57.4,14.31 57.4,12.68 U5.26
$1N33099: length 3.6
  Bottom Layer w0.254: U5.27 58.09,14.29 57.42,14.95 C14.2
$1N33110: length 6.1
  Bottom Layer w0.254: C15.2 43.37,16.22 42.54,16.22 42.29,15.96 42.29,14.69 42.54,14.44 42.54,12.8 U5.5
$1N33111: length 5.4
  Bottom Layer w0.254: C15.1 42.99,16.66 42.96,16.62 42.38,16.62 41.88,16.13 41.88,14.53 41.99,14.42 U5.4
$1N33112: length 3.5
  Bottom Layer w0.254: U5.3 41.29,15.76 C16.1
$1N33113: length 5.5
  Bottom Layer w0.254: U5.2 40.59,15 39.88,15.71 39.88,16.28 C16.2
$1N33117: length 8
  Top Layer w0.254: v1(55.48,16.05) 56.58,14.95 v1(59.82,14.95)
  Bottom Layer w0.254: v1(59.82,14.95) 58.93,14.95 58.79,14.81 U5.28
$1N33128: length 16.7
  Bottom Layer w0.254: R19.2 52.71,15.96 51.56,17.11 51.56,18.12 47.94,18.12 C19.1 47.82,16.34 47.88,16.34 47.88,14.82 47.75,14.69 ; U5.11 46.86,12.69 46.86,14.57 46.99,14.69 47.75,14.69 ; 47.75,14.69 48.64,14.69 49.02,14.31 48.99,14.28 U5.14
$1N36511: length 2
  Top Layer w0.254: LED9.1 71.76,41.01 R59.2
$1N36512: length 1.9
  Top Layer w0.254: R60.2 71.71,42.46 LED9.4
$1N36513: length 1.9
  Top Layer w0.254: R61.1 66.39,42.37 LED9.3
$1N40234: length 8.8
  Top Layer w0.254: 81.34,42.11 L1.2
  Top Layer w0.635: 81.34,38.96 81.34,42.11 84.34,39.1 C23.1
$1N40236: length 14.4
  Top Layer w0.635: C23.2 89.66,41.51 L2.1 90.34,42.55 95.42,47.63 96.27,47.63
$1N40247: length 16.2
  Top Layer w0.254: 79.44,38.96 79.44,38.5 80.26,37.68 82.3,37.68 82.93,37.05 89.03,37.05 89.66,36.41 89.66,34.75 R64.2 R65.1
$1N40253: length 7.5
  Top Layer w0.635: C27.2 v1(97.92,31.58) 97.92,33.5 R66.1
  Bottom Layer w0.254: v1(94.65,30) 96.33,30 v1(97.92,31.58)
$1N40259: length 2.7
  Top Layer w0.254: U9.2 83.32,31.2 R68.2
$1N40260: length 4.7
  Top Layer w0.254: R70.1 72.68,31.2 U9.7
$1N40261: length 4.2
  Top Layer w0.254: U9.6 74.58,32.84 R71.1
$1N40276: length 2.1
  Top Layer w0.254: R70.2 67.31,29.46 CHRGING.1
$1N40277: length 1.6
  Top Layer w0.254: R71.2 69.41,32.86 67.82,32.86
$1N44946: length 2.1
  Top Layer w0.254: 3V3.1 7.06,25.36 R72.2
$1N51257: length 8.4
  Top Layer w0.254: R73.1 68.59,7.96 69.98,7.96 70.8,8.79 Q3.1
$1N51262: length 5.2
  Top Layer w0.254: Q3.2 68.9,16.95 BUZZER1.1

## Copper pours and planes (outline as drawn; the poured copper is in the pictures)
GND on Top Layer: -11.43,65.49 106.3,65.49 106.3,-12.87 -11.43,-12.87
GND on Bottom Layer: -11.43,65.49 106.3,65.49 106.3,-12.87 -11.43,-12.87

## Text on the board
Bottom Silkscreen Layer: 3V3 | CLK | DIO | GND | BOOT0 | V1.1 | Charge | Output
Top Silkscreen Layer: LINK | Reset | - | + | JLCJLCJLCJLC | GND | B12 | B13 | B14 | 3.3 | RST | B15 | B11 | A8 | B10 | A9 | A10 | B1 | A11 | B0 | A12 | A7 | A15 | A6 | A5 | B3 | A4 | B4 | B5 | A3 | A2 | B6 | A1 | B7 | A0 | B8 | B9 | 5V | C13 | BAT
